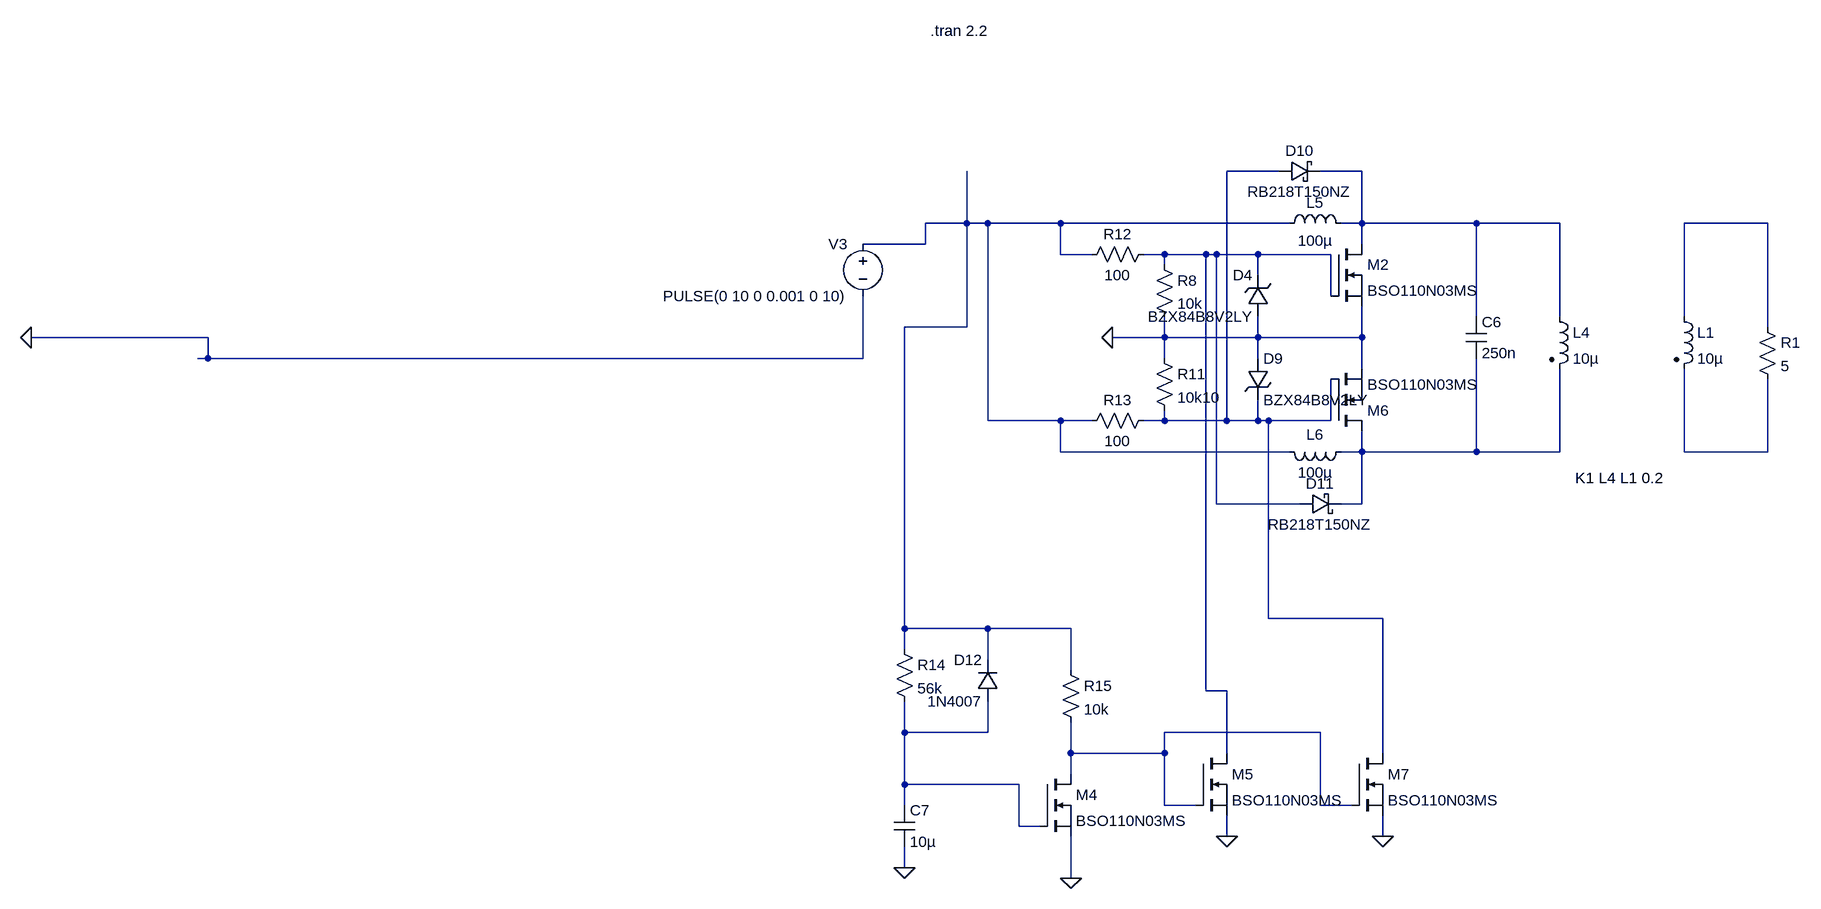
[diagram p0: schematic combinedV2.asc]
combinedV2.asc, the LTspice schematic file:
Version 4
SHEET 1 2732 1648
WIRE -256 -48 -336 -48
WIRE -128 -48 -192 -48
WIRE -736 32 -736 -48
WIRE -736 32 -800 32
WIRE -704 32 -736 32
WIRE -592 32 -704 32
WIRE -240 32 -592 32
WIRE -128 32 -128 -48
WIRE -128 32 -160 32
WIRE 48 32 -128 32
WIRE 176 32 48 32
WIRE 496 32 368 32
WIRE -800 64 -800 32
WIRE -800 64 -896 64
WIRE -128 64 -128 32
WIRE -592 80 -592 32
WIRE -544 80 -592 80
WIRE -432 80 -464 80
WIRE -368 80 -432 80
WIRE -352 80 -368 80
WIRE -288 80 -352 80
WIRE -176 80 -288 80
WIRE -432 96 -432 80
WIRE -288 112 -288 80
WIRE -176 144 -176 80
WIRE 48 176 48 32
WIRE 176 176 176 32
WIRE 368 176 368 32
WIRE -736 192 -736 32
WIRE -736 192 -832 192
WIRE 496 192 496 32
WIRE -1904 208 -2176 208
WIRE -432 208 -432 176
WIRE -432 208 -512 208
WIRE -288 208 -288 176
WIRE -288 208 -432 208
WIRE -128 208 -128 160
WIRE -128 208 -288 208
WIRE -1904 240 -1904 208
WIRE -1904 240 -1920 240
WIRE -896 240 -896 144
WIRE -896 240 -1904 240
WIRE -432 240 -432 208
WIRE -288 240 -288 208
WIRE -128 256 -128 208
WIRE -704 336 -704 32
WIRE -592 336 -704 336
WIRE -544 336 -592 336
WIRE -432 336 -432 320
WIRE -432 336 -464 336
WIRE -336 336 -336 -48
WIRE -336 336 -432 336
WIRE -288 336 -288 304
WIRE -288 336 -336 336
WIRE -272 336 -288 336
WIRE -176 336 -176 272
WIRE -176 336 -272 336
WIRE -592 384 -592 336
WIRE -240 384 -592 384
WIRE -128 384 -128 352
WIRE -128 384 -160 384
WIRE 48 384 48 240
WIRE 48 384 -128 384
WIRE 176 384 176 256
WIRE 176 384 48 384
WIRE 368 384 368 256
WIRE 496 384 496 272
WIRE 496 384 368 384
WIRE -352 464 -352 80
WIRE -224 464 -352 464
WIRE -128 464 -128 384
WIRE -128 464 -160 464
WIRE -272 640 -272 336
WIRE -96 640 -272 640
WIRE -832 656 -832 192
WIRE -704 656 -832 656
WIRE -576 656 -704 656
WIRE -832 688 -832 656
WIRE -704 704 -704 656
WIRE -576 720 -576 656
WIRE -368 752 -368 80
WIRE -336 752 -368 752
WIRE -832 816 -832 768
WIRE -704 816 -704 768
WIRE -704 816 -832 816
WIRE -192 816 -432 816
WIRE -576 848 -576 800
WIRE -432 848 -432 816
WIRE -432 848 -576 848
WIRE -336 848 -336 752
WIRE -96 848 -96 640
WIRE -576 880 -576 848
WIRE -832 896 -832 816
WIRE -656 896 -832 896
WIRE -832 928 -832 896
WIRE -432 928 -432 848
WIRE -384 928 -432 928
WIRE -192 928 -192 816
WIRE -144 928 -192 928
WIRE -656 960 -656 896
WIRE -624 960 -656 960
WIRE -336 976 -336 944
WIRE -96 976 -96 944
WIRE -832 1024 -832 992
WIRE -576 1040 -576 976
FLAG -512 208 0
FLAG -832 1024 0
FLAG -576 1040 0
FLAG -96 976 0
FLAG -336 976 0
FLAG -2176 208 0
SYMBOL cap 32 176 R0
SYMATTR InstName C6
SYMATTR Value 250n
SYMBOL ind2 160 160 R0
SYMATTR InstName L4
SYMATTR Value 10µ
SYMATTR SpiceLine Rser=1m
SYMATTR Type ind
SYMBOL nmos -176 64 R0
SYMATTR InstName M2
SYMATTR Value BSO110N03MS
SYMBOL nmos -176 352 M180
SYMATTR InstName M6
SYMATTR Value BSO110N03MS
SYMBOL zener -272 176 R180
WINDOW 0 24 64 Left 2
WINDOW 3 24 0 Left 2
SYMATTR InstName D4
SYMATTR Value BZX84B8V2LY
SYMATTR Description Diode
SYMATTR Type diode
SYMBOL zener -304 240 R0
SYMATTR InstName D9
SYMATTR Value BZX84B8V2LY
SYMATTR Description Diode
SYMATTR Type diode
SYMBOL ind -256 48 R270
WINDOW 0 32 56 VTop 2
WINDOW 3 5 56 VBottom 2
SYMATTR InstName L5
SYMATTR Value 100µ
SYMATTR SpiceLine Rser=1m
SYMBOL ind -144 368 R90
WINDOW 0 5 56 VBottom 2
WINDOW 3 32 56 VTop 2
SYMATTR InstName L6
SYMATTR Value 100µ
SYMATTR SpiceLine Rser=1m
SYMBOL res -448 80 R0
SYMATTR InstName R8
SYMATTR Value 10k
SYMBOL res -448 224 R0
SYMATTR InstName R11
SYMATTR Value 10k10
SYMBOL res -448 64 R90
WINDOW 0 0 56 VBottom 2
WINDOW 3 32 56 VTop 2
SYMATTR InstName R12
SYMATTR Value 100
SYMBOL res -448 320 R90
WINDOW 0 0 56 VBottom 2
WINDOW 3 32 56 VTop 2
SYMATTR InstName R13
SYMATTR Value 100
SYMBOL schottky -256 -32 R270
WINDOW 0 32 32 VTop 2
WINDOW 3 0 32 VBottom 2
SYMATTR InstName D10
SYMATTR Value RB218T150NZ
SYMATTR Description Diode
SYMATTR Type diode
SYMBOL schottky -224 448 M90
WINDOW 0 0 32 VBottom 2
WINDOW 3 32 32 VTop 2
SYMATTR InstName D11
SYMATTR Value RB218T150NZ
SYMATTR Description Diode
SYMATTR Type diode
SYMBOL res -848 672 R0
SYMATTR InstName R14
SYMATTR Value 56k
SYMBOL diode -688 768 R180
WINDOW 0 24 64 Left 2
WINDOW 3 24 0 Left 2
SYMATTR InstName D12
SYMATTR Value 1N4007
SYMBOL res -592 704 R0
SYMATTR InstName R15
SYMATTR Value 10k
SYMBOL cap -848 928 R0
SYMATTR InstName C7
SYMATTR Value 10µ
SYMBOL nmos -624 880 R0
SYMATTR InstName M4
SYMATTR Value BSO110N03MS
SYMBOL nmos -384 848 R0
SYMATTR InstName M5
SYMATTR Value BSO110N03MS
SYMBOL nmos -144 848 R0
SYMATTR InstName M7
SYMATTR Value BSO110N03MS
SYMBOL voltage -896 48 M0
WINDOW 123 0 0 Left 0
WINDOW 39 0 0 Left 0
SYMATTR InstName V3
SYMATTR Value PULSE(0 10 0 0.001 0 10)
SYMBOL ind2 352 160 R0
SYMATTR InstName L1
SYMATTR Value 10µ
SYMATTR SpiceLine Rser=1m
SYMATTR Type ind
SYMBOL res 480 176 R0
SYMATTR InstName R1
SYMATTR Value 5
TEXT -792 -264 Left 2 !.tran 2.2
TEXT 200 424 Left 2 !K1 L4 L1 0.2

The netlist it stands for:
* combinedV2.asc
C6 N002 N006 250n
L4 N002 N006 10µ Rser=1m
M2 N002 N005 0 0 BSO110N03MS
M6 N006 N001 0 0 BSO110N03MS
D4 0 N005 BZX84B8V2LY
D9 0 N001 BZX84B8V2LY
L5 N003 N002 100µ Rser=1m
L6 N006 N003 100µ Rser=1m
R8 N005 0 10k
R11 0 N001 10k10
R12 N005 N003 100
R13 N001 N003 100
D10 N001 N002 RB218T150NZ
D11 N005 N006 RB218T150NZ
R14 N003 N008 56k
D12 N008 N003 1N4007
R15 N003 N009 10k
C7 N008 0 10µ
M4 N009 N008 0 0 BSO110N03MS
M5 N005 N009 0 0 BSO110N03MS
M7 N001 N009 0 0 BSO110N03MS
V3 N003 0 PULSE(0 10 0 0.001 0 10)
L1 N004 N007 10µ Rser=1m
R1 N004 N007 5
.model D D
.lib standard.dio
.model NMOS NMOS
.model PMOS PMOS
.lib standard.mos
.tran 2.2
K1 L4 L1 0.2
.backanno
.end